# EasyEDA schematic Sheet_1.json
TITLE: Keyboard mark-2; REV: 1.0; Date: 2024-08-06; Sheet: 1/1; Drawn By: k754a; Company: Your Company
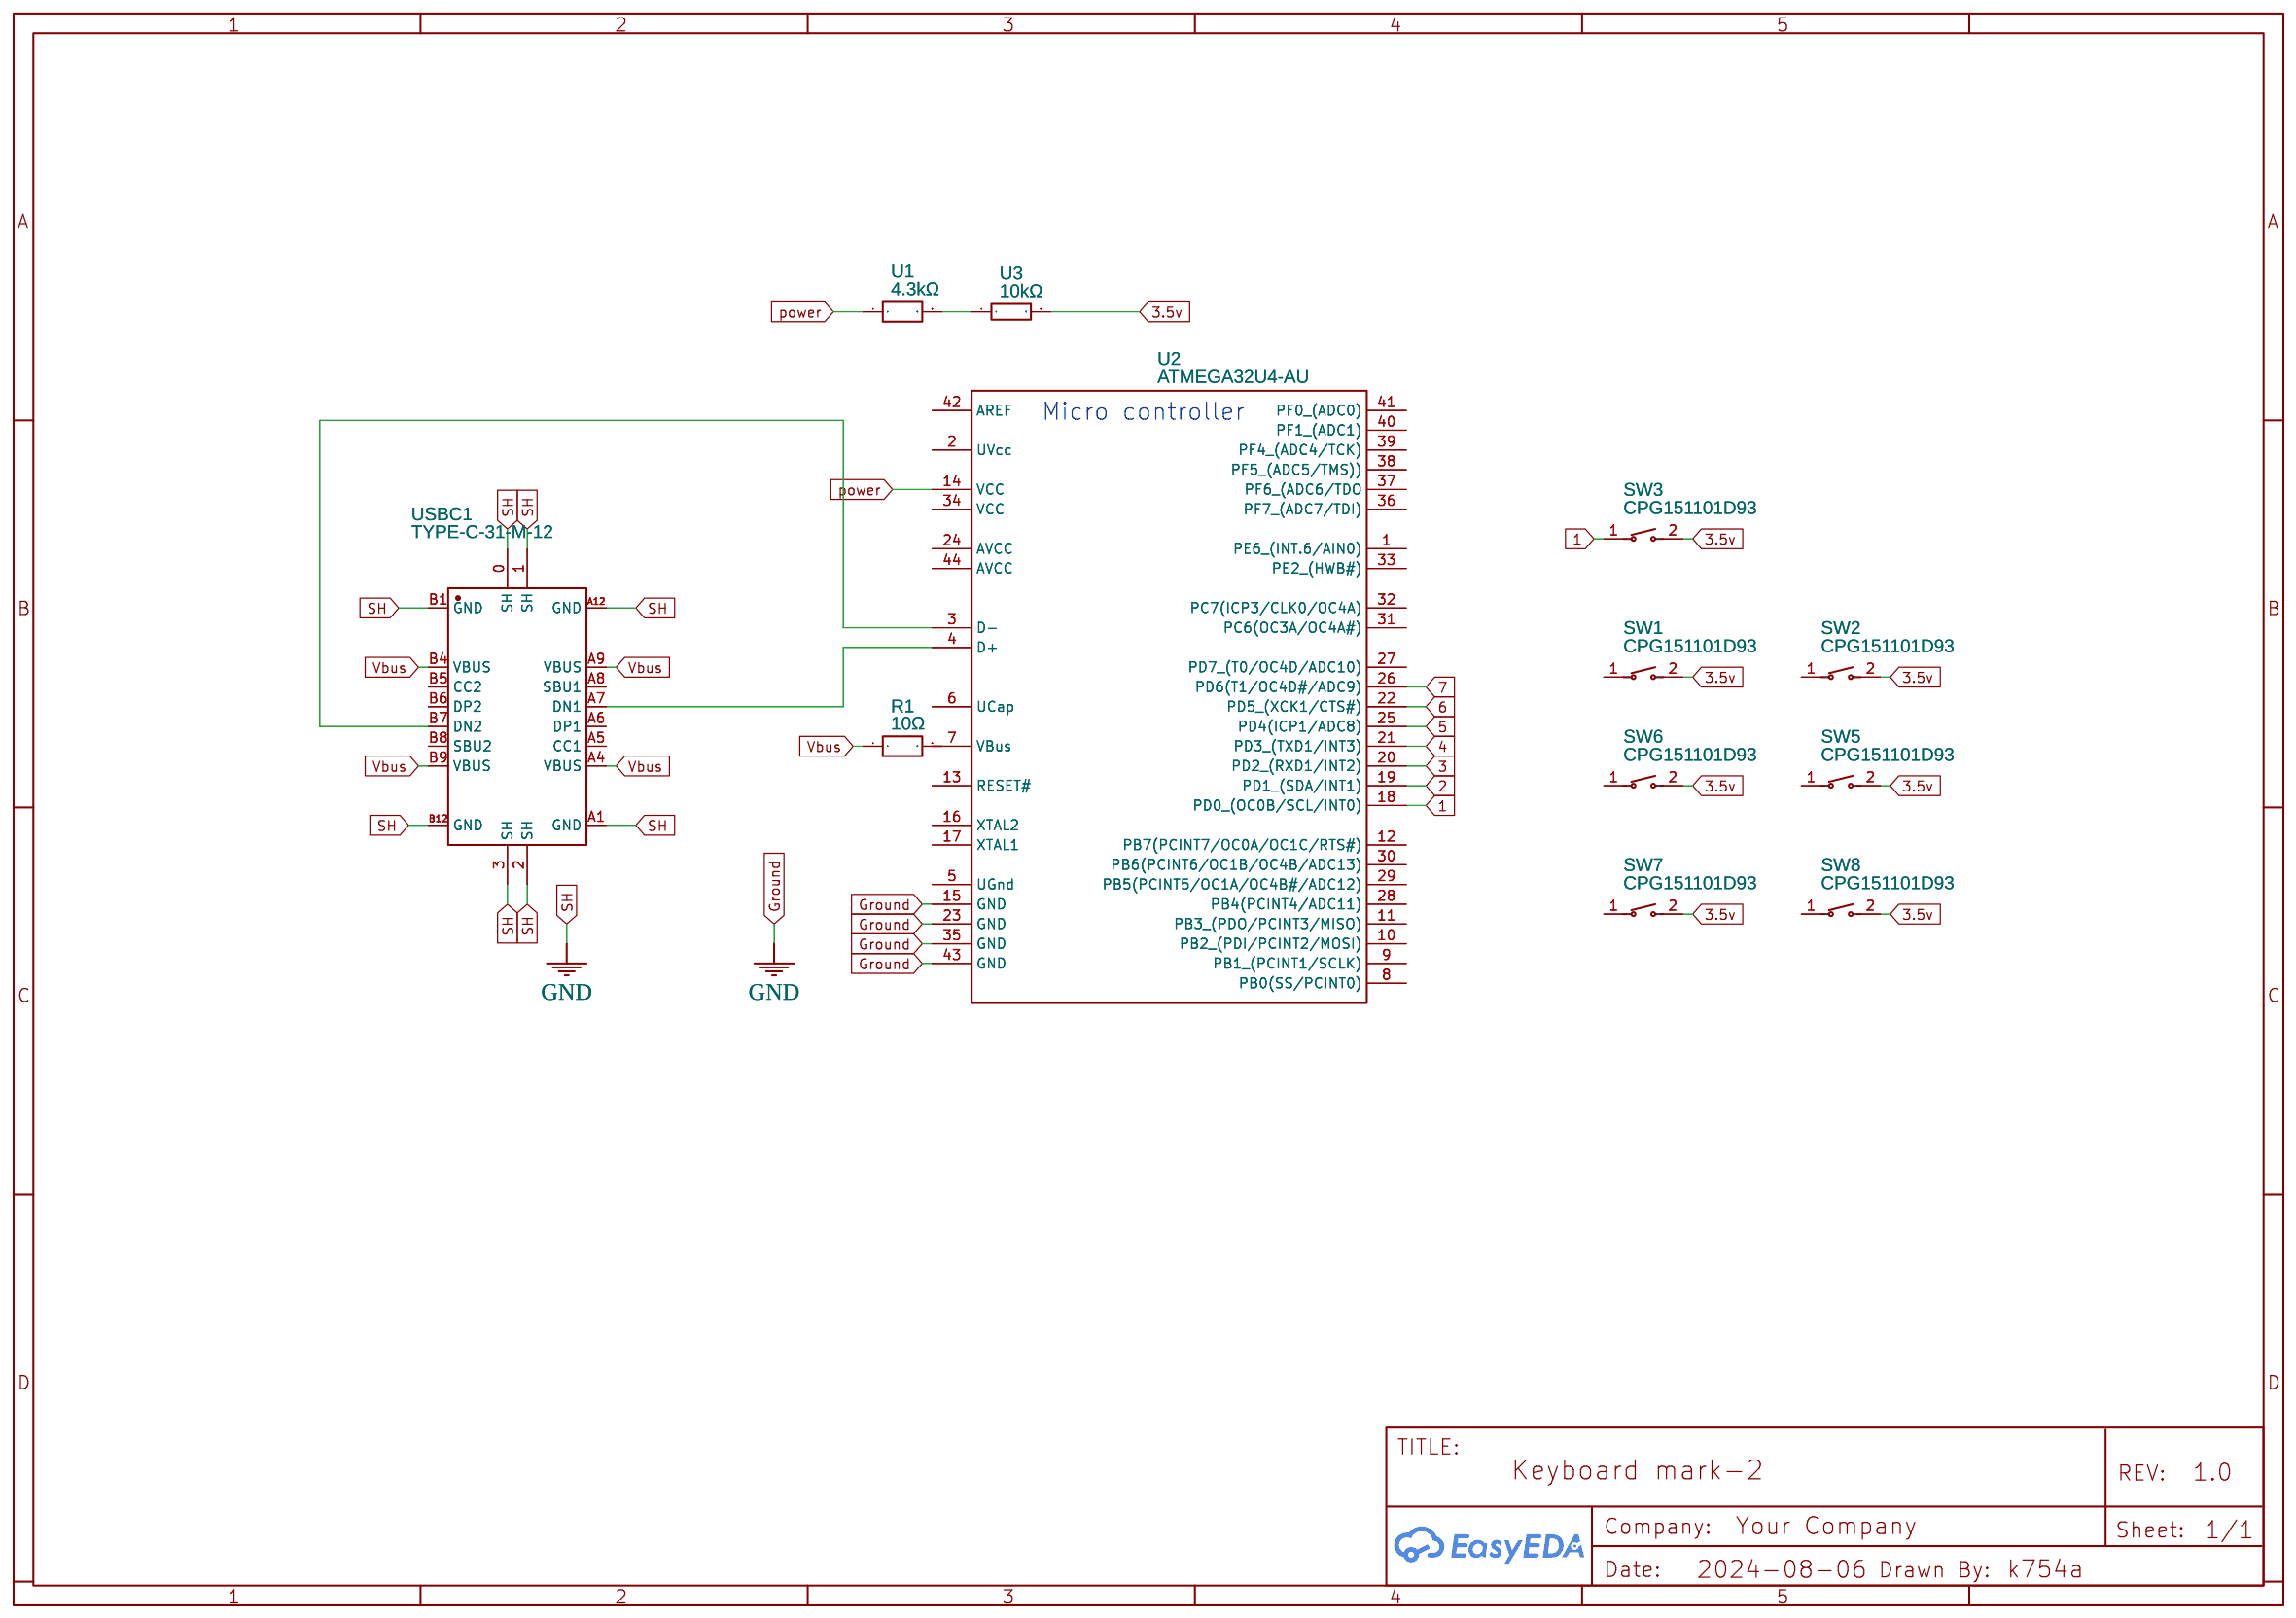
[diagram p0: schematic sheet]

## Parts
R1  10Ω  [10Ω_1W]
SW1  CPG151101D93  [SW-TH_CPG151101D9X]
SW2  CPG151101D93  [SW-TH_CPG151101D9X]
SW3  CPG151101D93  [SW-TH_CPG151101D9X]
SW5  CPG151101D93  [SW-TH_CPG151101D9X]
SW6  CPG151101D93  [SW-TH_CPG151101D9X]
SW7  CPG151101D93  [SW-TH_CPG151101D9X]
SW8  CPG151101D93  [SW-TH_CPG151101D9X]
U1  4.3kΩ  [RES-TH_BD2.3-L3.7-P7.70-D0.4]
U2  ATMEGA32U4-AU  [QFP-44_L10.0-W10.0-P0.80-LS13.2-BL]
U3  10kΩ  [R0603]
USBC1  TYPE-C-31-M-12  [USB-C_SMD-TYPE-C-31-M-12]

## Library data of the parts
R1 = 10Ω_1W: Contributor: lcsc; Supplier: LCSC; Supplier Part: C2897176; Manufacturer: VO(翔胜); Manufacturer Part: CR1W-4K7±5%-TT63
SW1-SW3 SW5-SW8 = CPG151101D93: Contributor: LCSC; Supplier: LCSC; Supplier Part: C400237; Manufacturer: Kailh(凯华); JLCPCB Part Class: Extended Part
U1 = CR1/8W-4K3±5%-OT52: Contributor: lcsc; Supplier: LCSC; Supplier Part: C2897060; Manufacturer: VO(翔胜); JLCPCB Part Class: Extended Part
U2 = ATMEGA32U4-AU: Supplier: LCSC; Manufacturer: MICROCHIP(美国微芯); Supplier Part: C44854; JLCPCB Part Class: Extended Part
U3 = HV73V1JTTD1002F: Contributor: lcsc; Supplier: LCSC; Supplier Part: C3930526; Manufacturer: KOA
USBC1 = TYPE-C-31-M-12: Contributor: LCSC; Supplier: LCSC; Supplier Part: C165948; Manufacturer: 韩国韩荣; JLCPCB Part Class: Extended Part

## Nets
3.5v: SW1.2 SW2.2 SW3.2 SW5.2 SW6.2 SW7.2 SW8.2 U3.2
GND: U2.15(GND) U2.23(GND) U2.35(GND) U2.43(GND) USBC1.0(SH) USBC1.1(SH) USBC1.2(SH) USBC1.3(SH) USBC1.A1(GND) USBC1.A12(GND) USBC1.B1(GND) USBC1.B12(GND)
Vbus: R1.1 USBC1.A4(VBUS) USBC1.A9(VBUS) USBC1.B4(VBUS) USBC1.B9(VBUS)
1: SW3.1 U2.18(PD0 (OC0B/SCL/INT0))
2: U2.19(PD1 (SDA/INT1))
3: U2.20(PD2 (RXD1/INT2))
4: U2.21(PD3 (TXD1/INT3))
5: U2.25(PD4(ICP1/ADC8))
6: U2.22(PD5 (XCK1/CTS#))
7: U2.26(PD6(T1/OC4D#/ADC9))
power: U1.1 U2.14(VCC)
Net-(R1-2): R1.2 U2.7(VBus)
Net-(U1-2): U1.2 U3.1
Net-(U2-3): U2.3(D-) USBC1.B7(DN2)
Net-(U2-4): U2.4(D+) USBC1.A7(DN1)

Not connected (* = marked no-connect by the designer): SW1 1; SW2 1; SW5 1; SW6 1; SW7 1; SW8 1; U2 1(PE6 (INT.6/AIN0)) 2(UVcc) 5(UGnd) 6(UCap) 8(PB0(SS/PCINT0)) 9(PB1 (PCINT1/SCLK)) 10(PB2 (PDI/PCINT2/MOSI)) 11(PB3 (PDO/PCINT3/MISO)) 12(PB7(PCINT7/OC0A/OC1C/RTS#)) 13(RESET#) 16(XTAL2) 17(XTAL1) 24(AVCC) 27(PD7 (T0/OC4D/ADC10)) 28(PB4(PCINT4/ADC11)) 29(PB5(PCINT5/OC1A/OC4B#/ADC12)) 30(PB6(PCINT6/OC1B/OC4B/ADC13)) 31(PC6(OC3A/OC4A#)) 32(PC7(ICP3/CLK0/OC4A)) 33(PE2 (HWB#)) 34(VCC) 36(PF7 (ADC7/TDI)) 37(PF6 (ADC6/TDO) 38(PF5 (ADC5/TMS))) 39(PF4 (ADC4/TCK)) 40(PF1 (ADC1)) 41(PF0 (ADC0)) 42(AREF) 44(AVCC); USBC1 A5(CC1) A6(DP1) A8(SBU1) B5(CC2) B6(DP2) B8(SBU2)

## Notes on the sheet
- Micro controller
